# EAGLE design atmega1284p-dip2 (EAGLE 7.1.0)
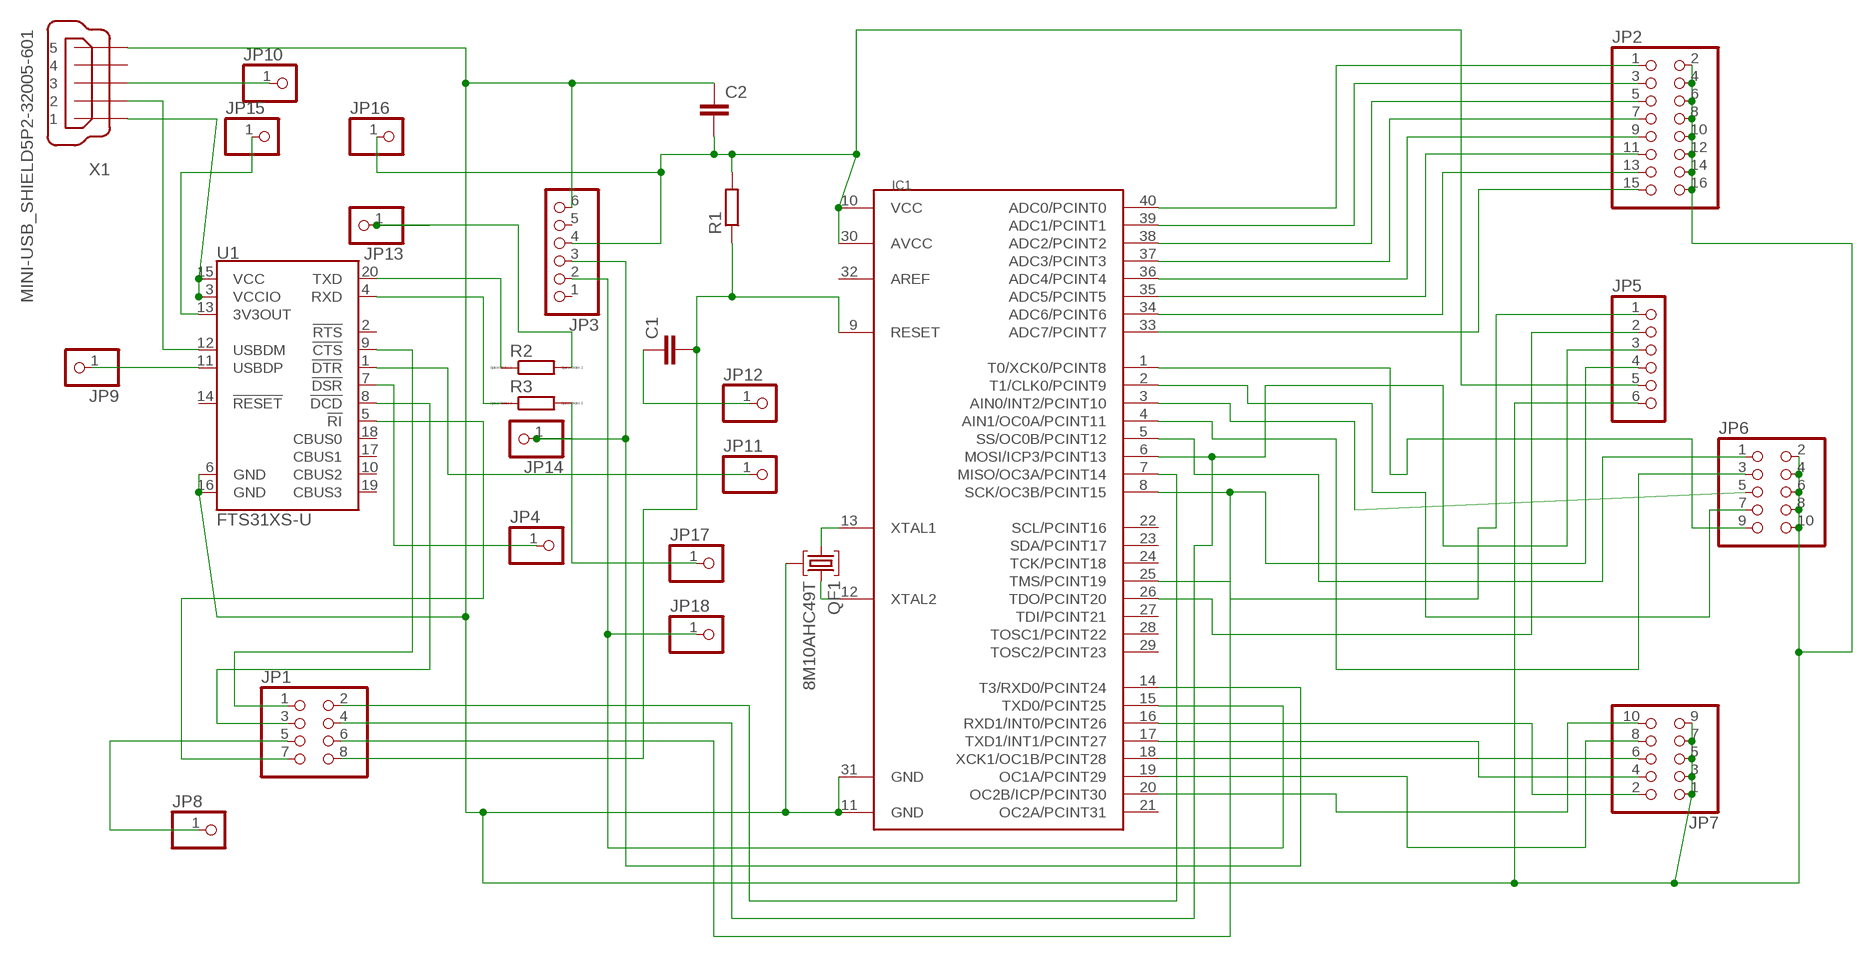
[diagram p0: schematic, sheet 1]

## Parts
C1  C-EUC0805  [C0805]
C2  C-EUC0805  [C0805]
IC1  MEGA1284P  [DIL40]
JP1  PINHD-2X4  [2X04]
JP2  PINHD-2X8  [2X08]
JP3  PINHD-1X6  [1X06]
JP4  PINHD-1X1  [1X01]
JP5  PINHD-1X6  [1X06]
JP6  PINHD-2X5  [2X05]
JP7  PINHD-2X5  [2X05]
JP8  PINHD-1X1  [1X01]
JP9  PINHD-1X1  [1X01]
JP10  PINHD-1X1  [1X01]
JP11  PINHD-1X1  [1X01]
JP12  PINHD-1X1  [1X01]
JP13  PINHD-1X1  [1X01]
JP14  PINHD-1X1  [1X01]
JP15  PINHD-1X1  [1X01]
JP16  PINHD-1X1  [1X01]
JP17  PINHD-1X1  [1X01]
JP18  PINHD-1X1  [1X01]
QF1  8M10AHC49T  [HC49U]
R1  R-EU_R0805  [R0805]
R2  RR0603  [R0603]
R3  RR0603  [R0603]
U1  FTS31XS-U  FT231XS  [SSOP20_L]
X1  MINI-USB_SHIELD5P2-32005-601  [32005-601]

## Nets
N$1: IC1.40(ADC0/PCINT0) JP2.1
N$2: IC1.39(ADC1/PCINT1) JP2.3
N$3: IC1.6(MOSI/ICP3/PCINT13) JP1.4 JP5.3
N$4: C2.1 IC1.11(GND) IC1.31(GND) JP2.2 JP2.4 JP2.6 JP2.8 JP2.10 JP2.12 JP2.14 JP2.16 JP3.6 JP5.6 JP6.2 JP6.4 JP6.6 JP6.8 JP6.10 JP7.1 JP7.3 JP7.5 JP7.7 JP7.9 QF1.2 U1.6(GND) U1.16(GND) X1.5
N$5: IC1.13(XTAL1) QF1.1
N$6: IC1.12(XTAL2) QF1.3
N$7: U1.3(VCCIO) U1.15(VCC) X1.1
N$8: IC1.8(SCK/OC3B/PCINT15) JP1.6 JP5.4
N$9: IC1.16(RXD1/INT0/PCINT26) JP7.2
N$10: C1.2 IC1.9(RESET) JP1.8 R1.1
N$11: JP11.1 U1.1(!DTR)
N$12: IC1.15(TXD0/PCINT25) JP3.2 JP18.1
N$13: IC1.14(T3/RXD0/PCINT24) JP3.3 JP14.1
N$14: IC1.25(TMS/PCINT19) JP5.1
N$15: IC1.26(TDO/PCINT20) JP5.2
N$16: IC1.17(TXD1/INT1/PCINT27) JP7.4
N$17: IC1.38(ADC2/PCINT2) JP2.5
N$18: IC1.37(ADC3/PCINT3) JP2.7
N$19: IC1.36(ADC4/PCINT4) JP2.9
N$20: IC1.35(ADC5/PCINT5) JP2.11
N$21: IC1.34(ADC6/PCINT6) JP2.13
N$22: IC1.33(ADC7/PCINT7) JP2.15
N$23: IC1.1(T0/XCK0/PCINT8) JP6.9
N$24: IC1.2(T1/CLK0/PCINT9) JP6.7
N$25: IC1.3(AIN0/INT2/PCINT10) JP6.5
N$26: IC1.4(AIN1/OC0A/PCINT11) JP6.3
N$27: IC1.5(SS/OC0B/PCINT12) JP6.1
N$28: IC1.18(XCK1/OC1B/PCINT28) JP7.6
N$29: IC1.19(OC1A/PCINT29) JP7.8
N$30: IC1.20(OC2B/ICP/PCINT30) JP7.10
N$31: IC1.7(MISO/OC3A/PCINT14) JP1.2
N$32: C2.2 IC1.10(VCC) IC1.30(AVCC) JP3.4 JP5.5 JP16.1 R1.2
N$33: U1.12(USBDM) X1.2
N$34: JP9.1 U1.11(USBDP)
N$35: R2.1 U1.20(TXD)
N$36: R3.1 U1.4(RXD)
N$37: JP4.1 U1.7(!DSR)
N$38: JP1.1 U1.9(!CTS)
N$39: JP1.3 U1.8(!DCD)
N$40: JP1.5 JP8.1
N$41: JP1.7 U1.5(!RI)
N$42: JP10.1 X1.3
N$43: C1.1 JP12.1
N$44: JP13.1 R2.2
N$45: JP15.1 U1.13(3V3OUT)
N$47: JP17.1 R3.2
Unconnected: IC1.21(OC2A/PCINT31) IC1.22(SCL/PCINT16) IC1.23(SDA/PCINT17) IC1.24(TCK/PCINT18) IC1.27(TDI/PCINT21) IC1.28(TOSC1/PCINT22) IC1.29(TOSC2/PCINT23) IC1.32(AREF) JP3.1 JP3.5 U1.2(!RTS) U1.10(CBUS2) U1.14(!RESET) U1.17(CBUS1) U1.18(CBUS0) U1.19(CBUS3) X1.4 X1.M1(S1) X1.M2(S2)

## Library data of the parts
C1 C2 = rcl:C-EU: CAPACITOR, European symbol
IC1 = 1284p:MEGA1284P: Atmel ATmega1284P 8-bit AVR Microcontroller
JP1 = pinhead:PINHD-2X4: PIN HEADER
JP2 = pinhead:PINHD-2X8: PIN HEADER
JP3 JP5 = pinhead:PINHD-1X6: PIN HEADER
JP4 JP8-JP18 = pinhead:PINHD-1X1: PIN HEADER
JP6 JP7 = pinhead:PINHD-2X5: PIN HEADER
QF1 = crystal:8M10AHC49T: Monolithic Crystal Filters Source: www.vanlong.com; OC_FARNELL: unknown; OC_NEWARK: unknown
R1 = rcl:R-EU_: RESISTOR, European symbol
R2 R3 = eagle-ltspice:R: RESISTOR, European symbol; SPICEMODEL: NONE; SPICEPREFIX: R
U1 = SparkFun-DigitalIC:FT231X: FTDI FT231X Full Speed USB to Full-handshake UART This USB2.0 Full Speed IC offers a compact bridge to full handshake UART interfaces. The device is a UART, capable of operating up to 3MBaud, with low power consumption (8mA). The FT231X includes the complete FT-X series feature set and enables USB to be added into a system design quickly and easily over a UART interface.; PROD_ID: IC-11524
X1 = con-cypressindustries:MINI-USB_SHIELD5P2-: MINI USB-B R/A DIP 5pol. Source: www.cypressindustries.com; OC_FARNELL: unknown; OC_NEWARK: unknown

## Board
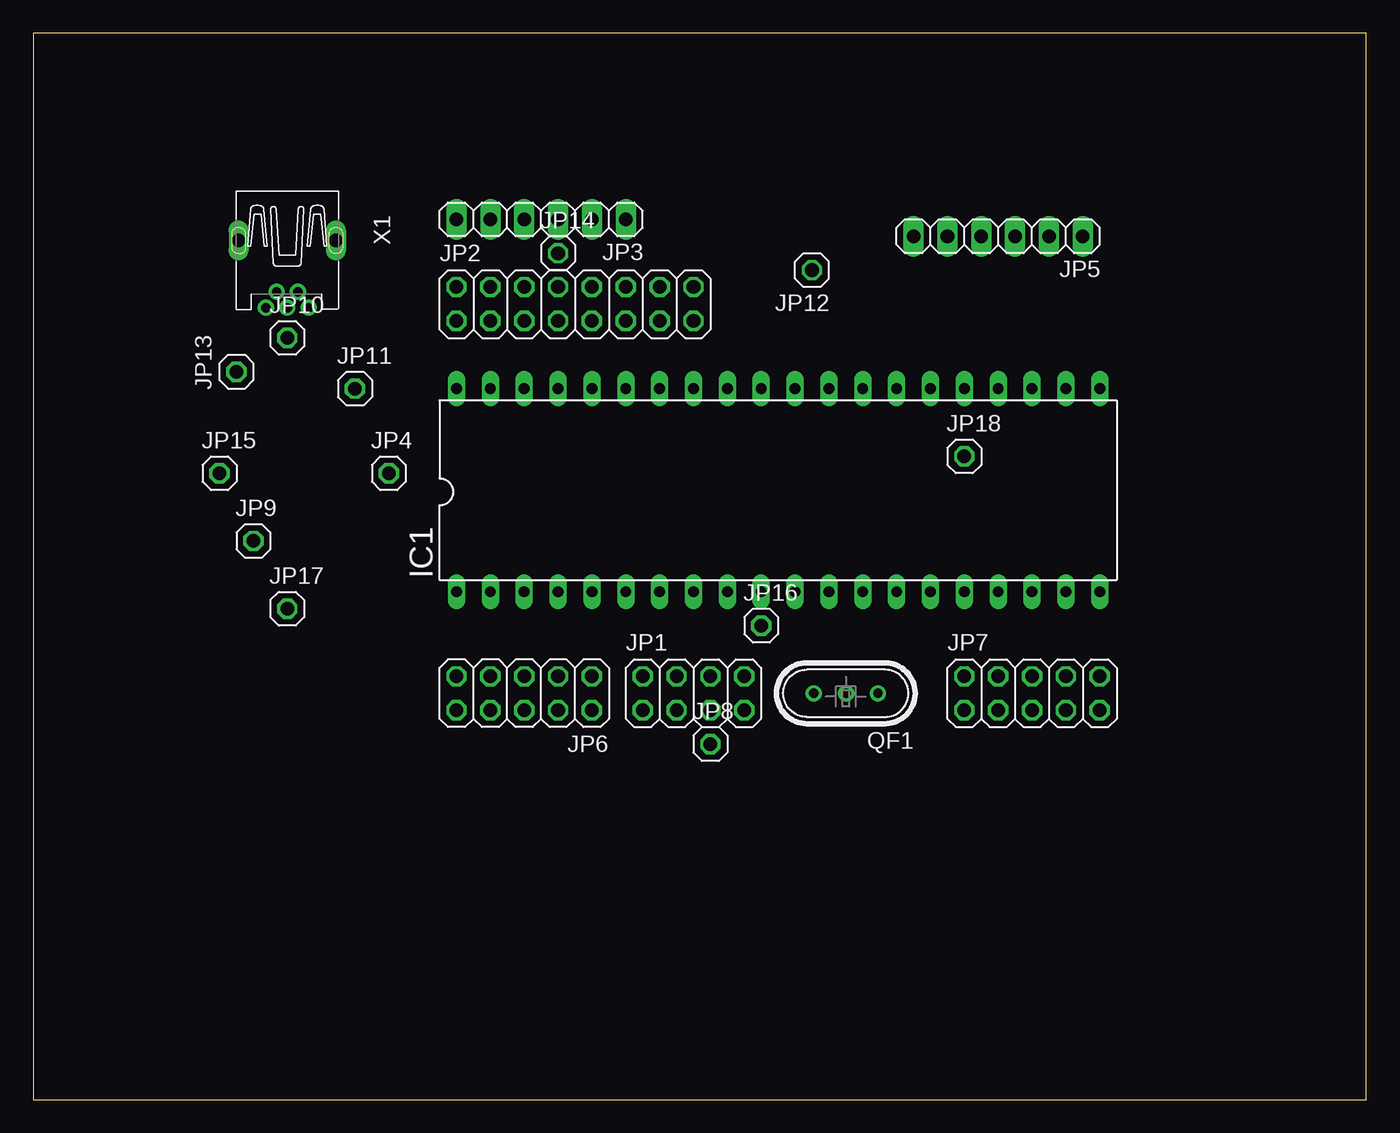
[diagram p1: board, top side]
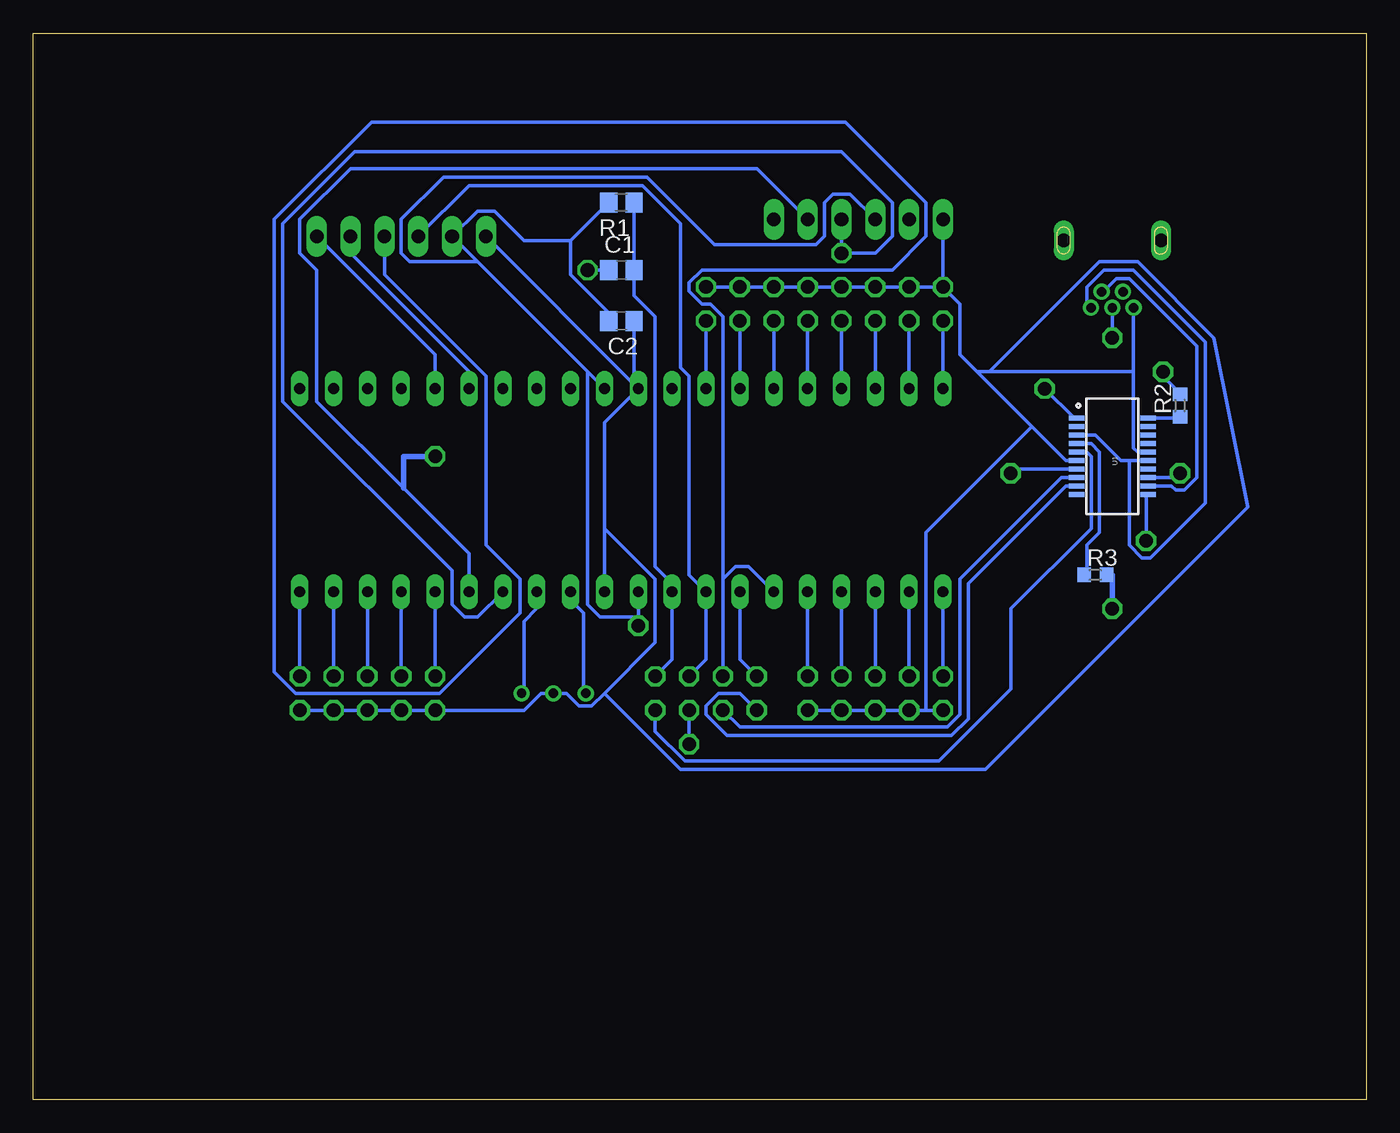
[diagram p2: board, bottom side, seen from below]

Size 100 x 80 mm. Coordinates in mm from the lower left corner, seen from the top.
Outline: 0,0 100,0 100,80 0,80 0,0
Copper layers (1*16): Top 0.035mm / dielectric 1.5mm / Bottom 0.035mm
Design rules "default": minimum track width 10mil, minimum drill 24mil, track to track 8mil, track to pad 8mil, pad to pad 8mil, via to via 8mil, smd to smd 8mil, copper to edge 40mil, drill to drill 8mil, minimum pad ring 10mil, minimum via ring 8mil, stop-mask expansion 4mil, vias tented up to drill 0mil, thermal gap 10mil

### Footprints (pad centres in the part's own frame; a part is rotated, then mirrored left to right if it is on the bottom)
C0805 = smd 1.3 x 1.5: 1 -0.95,0; 2 0.95,0
DIL40 = drill 0.813 long: 1 -24.13,-7.62; 2 -21.59,-7.62; 3 -19.05,-7.62; 4 -16.51,-7.62; 5 -13.97,-7.62; 6 -11.43,-7.62; 7 -8.89,-7.62; 8 -6.35,-7.62; 9 -3.81,-7.62; 10 -1.27,-7.62; 11 1.27,-7.62; 12 3.81,-7.62; 13 6.35,-7.62; 14 8.89,-7.62; 15 11.43,-7.62; 16 13.97,-7.62; 17 16.51,-7.62; 18 19.05,-7.62; 19 21.59,-7.62; 20 24.13,-7.62; 21 24.13,7.62; 22 21.59,7.62; 23 19.05,7.62; 24 16.51,7.62; 25 13.97,7.62; 26 11.43,7.62; 27 8.89,7.62; 28 6.35,7.62; 29 3.81,7.62; 30 1.27,7.62; 31 -1.27,7.62; 32 -3.81,7.62; 33 -6.35,7.62; 34 -8.89,7.62; 35 -11.43,7.62; 36 -13.97,7.62; 37 -16.51,7.62; 38 -19.05,7.62; 39 -21.59,7.62; 40 -24.13,7.62
2X04 = drill 1.016 octagon: 1 -3.81,-1.27; 2 -3.81,1.27; 3 -1.27,-1.27; 4 -1.27,1.27; 5 1.27,-1.27; 6 1.27,1.27; 7 3.81,-1.27; 8 3.81,1.27
2X08 = drill 1.016 octagon: 1 -8.89,-1.27; 2 -8.89,1.27; 3 -6.35,-1.27; 4 -6.35,1.27; 5 -3.81,-1.27; 6 -3.81,1.27; 7 -1.27,-1.27; 8 -1.27,1.27; 9 1.27,-1.27; 10 1.27,1.27; 11 3.81,-1.27; 12 3.81,1.27; 13 6.35,-1.27; 14 6.35,1.27; 15 8.89,-1.27; 16 8.89,1.27
1X06 = drill 1.016 long: 1 -6.35,0; 2 -3.81,0; 3 -1.27,0; 4 1.27,0; 5 3.81,0; 6 6.35,0
1X01 = drill 1.016 octagon: 1 0,0
2X05 = drill 1.016 octagon: 1 -5.08,-1.27; 2 -5.08,1.27; 3 -2.54,-1.27; 4 -2.54,1.27; 5 0,-1.27; 6 0,1.27; 7 2.54,-1.27; 8 2.54,1.27; 9 5.08,-1.27; 10 5.08,1.27
HC49U = drill 0.7 pad 1.2: 1 -2.413,0; 2 -0.027,0; 3 2.413,0
R0805 = smd 1.3 x 1.5: 1 -0.95,0; 2 0.95,0
R0603 = smd 1 x 1.1: 1 -0.85,0; 2 0.85,0
SSOP20_L = smd 0.381 x 1.143: 1 -2.857,-2.68; 2 -2.223,-2.68; 3 -1.587,-2.68; 4 -0.953,-2.68; 5 -0.318,-2.68; 6 0.318,-2.68; 7 0.953,-2.68; 8 1.587,-2.68; 9 2.223,-2.68; 10 2.857,-2.68; 11 2.857,2.68; 12 2.223,2.68; 13 1.587,2.68; 14 0.953,2.68; 15 0.318,2.68; 16 -0.318,2.68; 17 -0.953,2.68; 18 -1.587,2.68; 19 -2.223,2.68; 20 -2.857,2.68
32005-601 = drill 0.7 pad 1.016: 1 2.825,1.6; 2 1.625,0.8; 3 2.825,0; 4 1.625,-0.8; 5 2.825,-1.6 | drill 1 pad 1.422 long: M1 -2.225,3.65; M2 -2.225,-3.65

### Placement (x,y rotation side)
C1  55.88,62.23 0 bottom
C2  55.88,58.42 180 bottom
IC1  55.88,45.72 0 top
JP1  49.53,30.48 0 top
JP2  40.64,59.69 0 top
JP3  38.1,66.04 180 top
JP4  26.67,46.99 0 top
JP5  72.39,64.77 180 top
JP6  36.83,30.48 180 top
JP7  74.93,30.48 0 top
JP8  50.8,26.67 0 top
JP9  16.51,41.91 0 top
JP10  19.05,57.15 0 top
JP11  24.13,53.34 0 top
JP12  58.42,62.23 180 top
JP13  15.24,54.61 90 top
JP14  39.37,63.5 0 top
JP15  13.97,46.99 0 top
JP16  54.61,35.56 0 top
JP17  19.05,36.83 0 top
JP18  69.85,48.26 0 top
QF1  60.96,30.48 180 top
R1  55.88,67.31 180 bottom
R2  13.97,52.07 90 bottom
R3  20.32,39.37 0 bottom
U1  19.05,48.26 270 bottom
X1  19.05,62.23 270 top

### Tracks (layer width: path | path; a pad name or v marks a point on that pad's centre or on a via)
N$1
  Bottom 0.254: JP2.1 IC1.40
N$2
  Bottom 0.254: JP2.3 IC1.39
N$3
  Bottom 0.254: IC1.6 46.35,40.01 47.31,40.01 48.26,39.05 | JP1.4 48.26,39.05 | JP5.3 73.66,61.91 66.04,54.29 66.04,41.59 63.5,39.05 63.5,36.51 69.53,30.48 80.33,30.48 81.92,32.07 81.92,66.04 74.61,73.34 39.05,73.34 33.02,67.31 33.02,64.77 35.56,62.23 49.85,62.23 50.8,61.28 50.8,60.64 49.85,59.69 49.21,59.69 48.26,58.74 48.26,39.05
N$4
  Bottom 0.254: JP7.9 JP7.7 JP7.5 JP7.3 JP7.1 63.18,29.21 61.91,30.48 QF1.2 60.01,30.48 59.05,29.53 58.1,29.53 57.15,30.48 | 54.93,53.66 C2.1 | 57.15,42.86 57.15,50.8 IC1.31 54.93,53.66 | 57.15,42.86 IC1.11 | 54.93,53.66 JP5.6 | 57.15,30.48 53.34,34.29 53.34,39.05 57.15,42.86 | 33.02,29.21 JP6.8 JP6.6 JP6.4 JP6.2 | 33.02,29.21 JP6.10 | U1.16 17.14,48.58 17.46,48.9 17.46,54.61 | 17.46,54.61 17.46,59.37 X1.5 | U1.6 22.54,47.94 25.08,50.48 | 29.21,54.61 30.48,55.88 30.48,59.69 JP2.2 | 29.21,54.61 25.08,50.48 | JP2.2 JP2.4 JP2.6 JP2.8 JP2.10 JP2.12 JP2.14 JP2.16 | JP2.2 JP3.6 | 29.21,54.61 28.26,54.61 | 28.26,54.61 17.46,54.61 | 33.02,29.21 33.02,42.55 25.08,50.48 | 57.15,30.48 51.44,24.77 28.57,24.77 8.89,44.45 11.43,57.15 17.14,62.87 20,62.87 28.26,54.61
N$5
  Bottom 0.254: IC1.13 62.23,36.83 63.18,35.88 63.18,30.48 QF1.1
N$6
  Bottom 0.254: IC1.12 59.69,37.47 58.74,36.51 58.74,30.48 QF1.3
N$7
  Bottom 0.254: 17.78,47.94 18.41,47.94 20.32,49.85 U1.3 | 17.78,47.94 U1.15 | 17.78,47.94 17.78,41.59 16.83,40.64 16.19,40.64 12.06,44.77 12.06,56.83 17.46,62.23 19.68,62.23 20.95,60.96 20.95,59.69 X1.1
N$8
  Bottom 0.254: JP1.6 49.53,33.02 IC1.8 50.8,39.37 50.8,54.29 51.44,54.93 51.44,65.72 54.29,68.58 67.31,68.58 JP5.4
N$9
  Bottom 0.254: JP7.2 IC1.16
N$10
  Bottom 0.254: C1.2 R1.1 | JP1.8 52.07,33.02 IC1.9 52.07,38.73 53.34,40.01 53.34,58.74 54.93,60.33 C1.2 | C1.2
N$11
  Bottom 0.254: JP11.1 21.91,51.12 U1.1
N$12
  Bottom 0.254: IC1.15 67.31,40.96 72.23,45.88 78.74,52.39 78.74,62.23 80.01,63.5 80.01,66.04 76.2,69.85 45.72,69.85 JP3.2
  Bottom 0.406: JP18.1 72.23,48.26 72.23,45.88
N$13
  Bottom 0.254: IC1.14 66.67,36.2 67.63,36.2 68.58,37.15 68.58,39.69 81.28,52.39 81.28,65.72 75.88,71.12 39.37,71.12 35.56,67.31 35.56,64.77 36.83,63.5 JP14.1 JP3.3
N$14
  Bottom 0.254: IC1.25 69.85,55.88 JP5.1
N$15
  Bottom 0.254: IC1.26 67.31,54.61 76.2,63.5 JP5.2
N$16
  Bottom 0.254: JP7.4 IC1.17
N$17
  Bottom 0.254: JP2.5 IC1.38
N$18
  Bottom 0.254: JP2.7 IC1.37
N$19
  Bottom 0.254: JP2.9 IC1.36
N$20
  Bottom 0.254: JP2.11 IC1.35
N$21
  Bottom 0.254: JP2.13 IC1.34
N$22
  Bottom 0.254: JP2.15 IC1.33
N$23
  Bottom 0.254: JP6.9 IC1.1
N$24
  Bottom 0.254: JP6.7 IC1.2
N$25
  Bottom 0.254: JP6.5 IC1.3
N$26
  Bottom 0.254: JP6.3 IC1.4
N$27
  Bottom 0.254: JP6.1 IC1.5
N$28
  Bottom 0.254: JP7.6 IC1.18
N$29
  Bottom 0.254: JP7.8 IC1.19
N$30
  Bottom 0.254: JP7.10 IC1.20
N$31
  Bottom 0.254: IC1.7 46.99,33.02 JP1.2
N$32
  Bottom 0.254: 59.69,64.45 59.69,61.91 56.83,59.05 C2.2 | 59.69,64.45 R1.2 | 54.61,36.2 IC1.10 | 66.67,62.87 JP5.5 66.67,66.67 65.41,66.67 63.18,64.45 59.69,64.45 | 66.67,62.87 58.42,54.61 | 58.42,54.61 IC1.30 | JP3.4 38.73,67.94 40.01,67.94 40.64,67.31 40.64,64.77 41.27,64.14 48.9,64.14 53.98,69.22 69.22,69.22 72.39,66.04 72.39,63.5 71.75,62.87 66.67,62.87 | 54.61,36.2 57.47,36.2 58.42,37.15 58.42,54.61 | 54.61,36.2 JP16.1
N$33
  Bottom 0.254: U1.12 14.61,46.04 14.29,45.72 13.65,45.72 12.7,46.67 12.7,56.52 17.78,61.59 18.73,61.59 19.68,60.64 X1.2
N$34
  Bottom 0.254: JP9.1 16.51,45.4 U1.11
N$35
  Bottom 0.254: U1.20 13.97,51.12 R2.1
N$36
  Bottom 0.254: U1.4 20.64,49.21 20,48.58 20,42.55 20.95,41.59 20.95,39.37 R3.1
N$37
  Bottom 0.254: U1.7 26.35,47.31 JP4.1
N$38
  Bottom 0.254: U1.9 22.54,46.04 29.84,38.73 29.84,28.57 31.11,27.3 47.94,27.3 49.53,28.89 49.53,29.53 48.58,30.48 46.99,30.48 JP1.1
N$39
  Bottom 0.254: U1.8 22.86,46.67 30.48,39.05 30.48,28.89 31.43,27.94 46.99,27.94 JP1.3
N$40
  Bottom 0.254: JP1.5 JP8.1
N$41
  Bottom 0.254: U1.5 20.95,48.58 20.64,48.26 20.64,42.86 26.67,36.83 26.67,30.8 32.07,25.4 51.12,25.4 53.34,27.62 JP1.7
N$42
  Bottom 0.254: JP10.1 X1.3
N$43
  Bottom 0.254: JP12.1 C1.1
N$44
  Bottom 0.254: JP13.1 15.24,54.29 13.97,53.02 R2.2
N$45
  Bottom 0.254: U1.13 14.29,46.67 JP15.1
N$47
  Bottom 0.406: R3.2 19.05,39.37 JP17.1